# EasyEDA Pro project ProProject_flex_ir_golf_2024-10-07.epro

# Schematic Schematic1
Create Date: 2024-04-06; Page Name: P1; Project Name: flex_ir_golf; Schematic Name: Schematic1; Update Date: 2024-08-27; Company: EasyEDA.com; Drawn: EasyEDA; Page Size: A4; Part Number: JLCPCB-002; Reviewed: EasyEDA; Version: V0.1
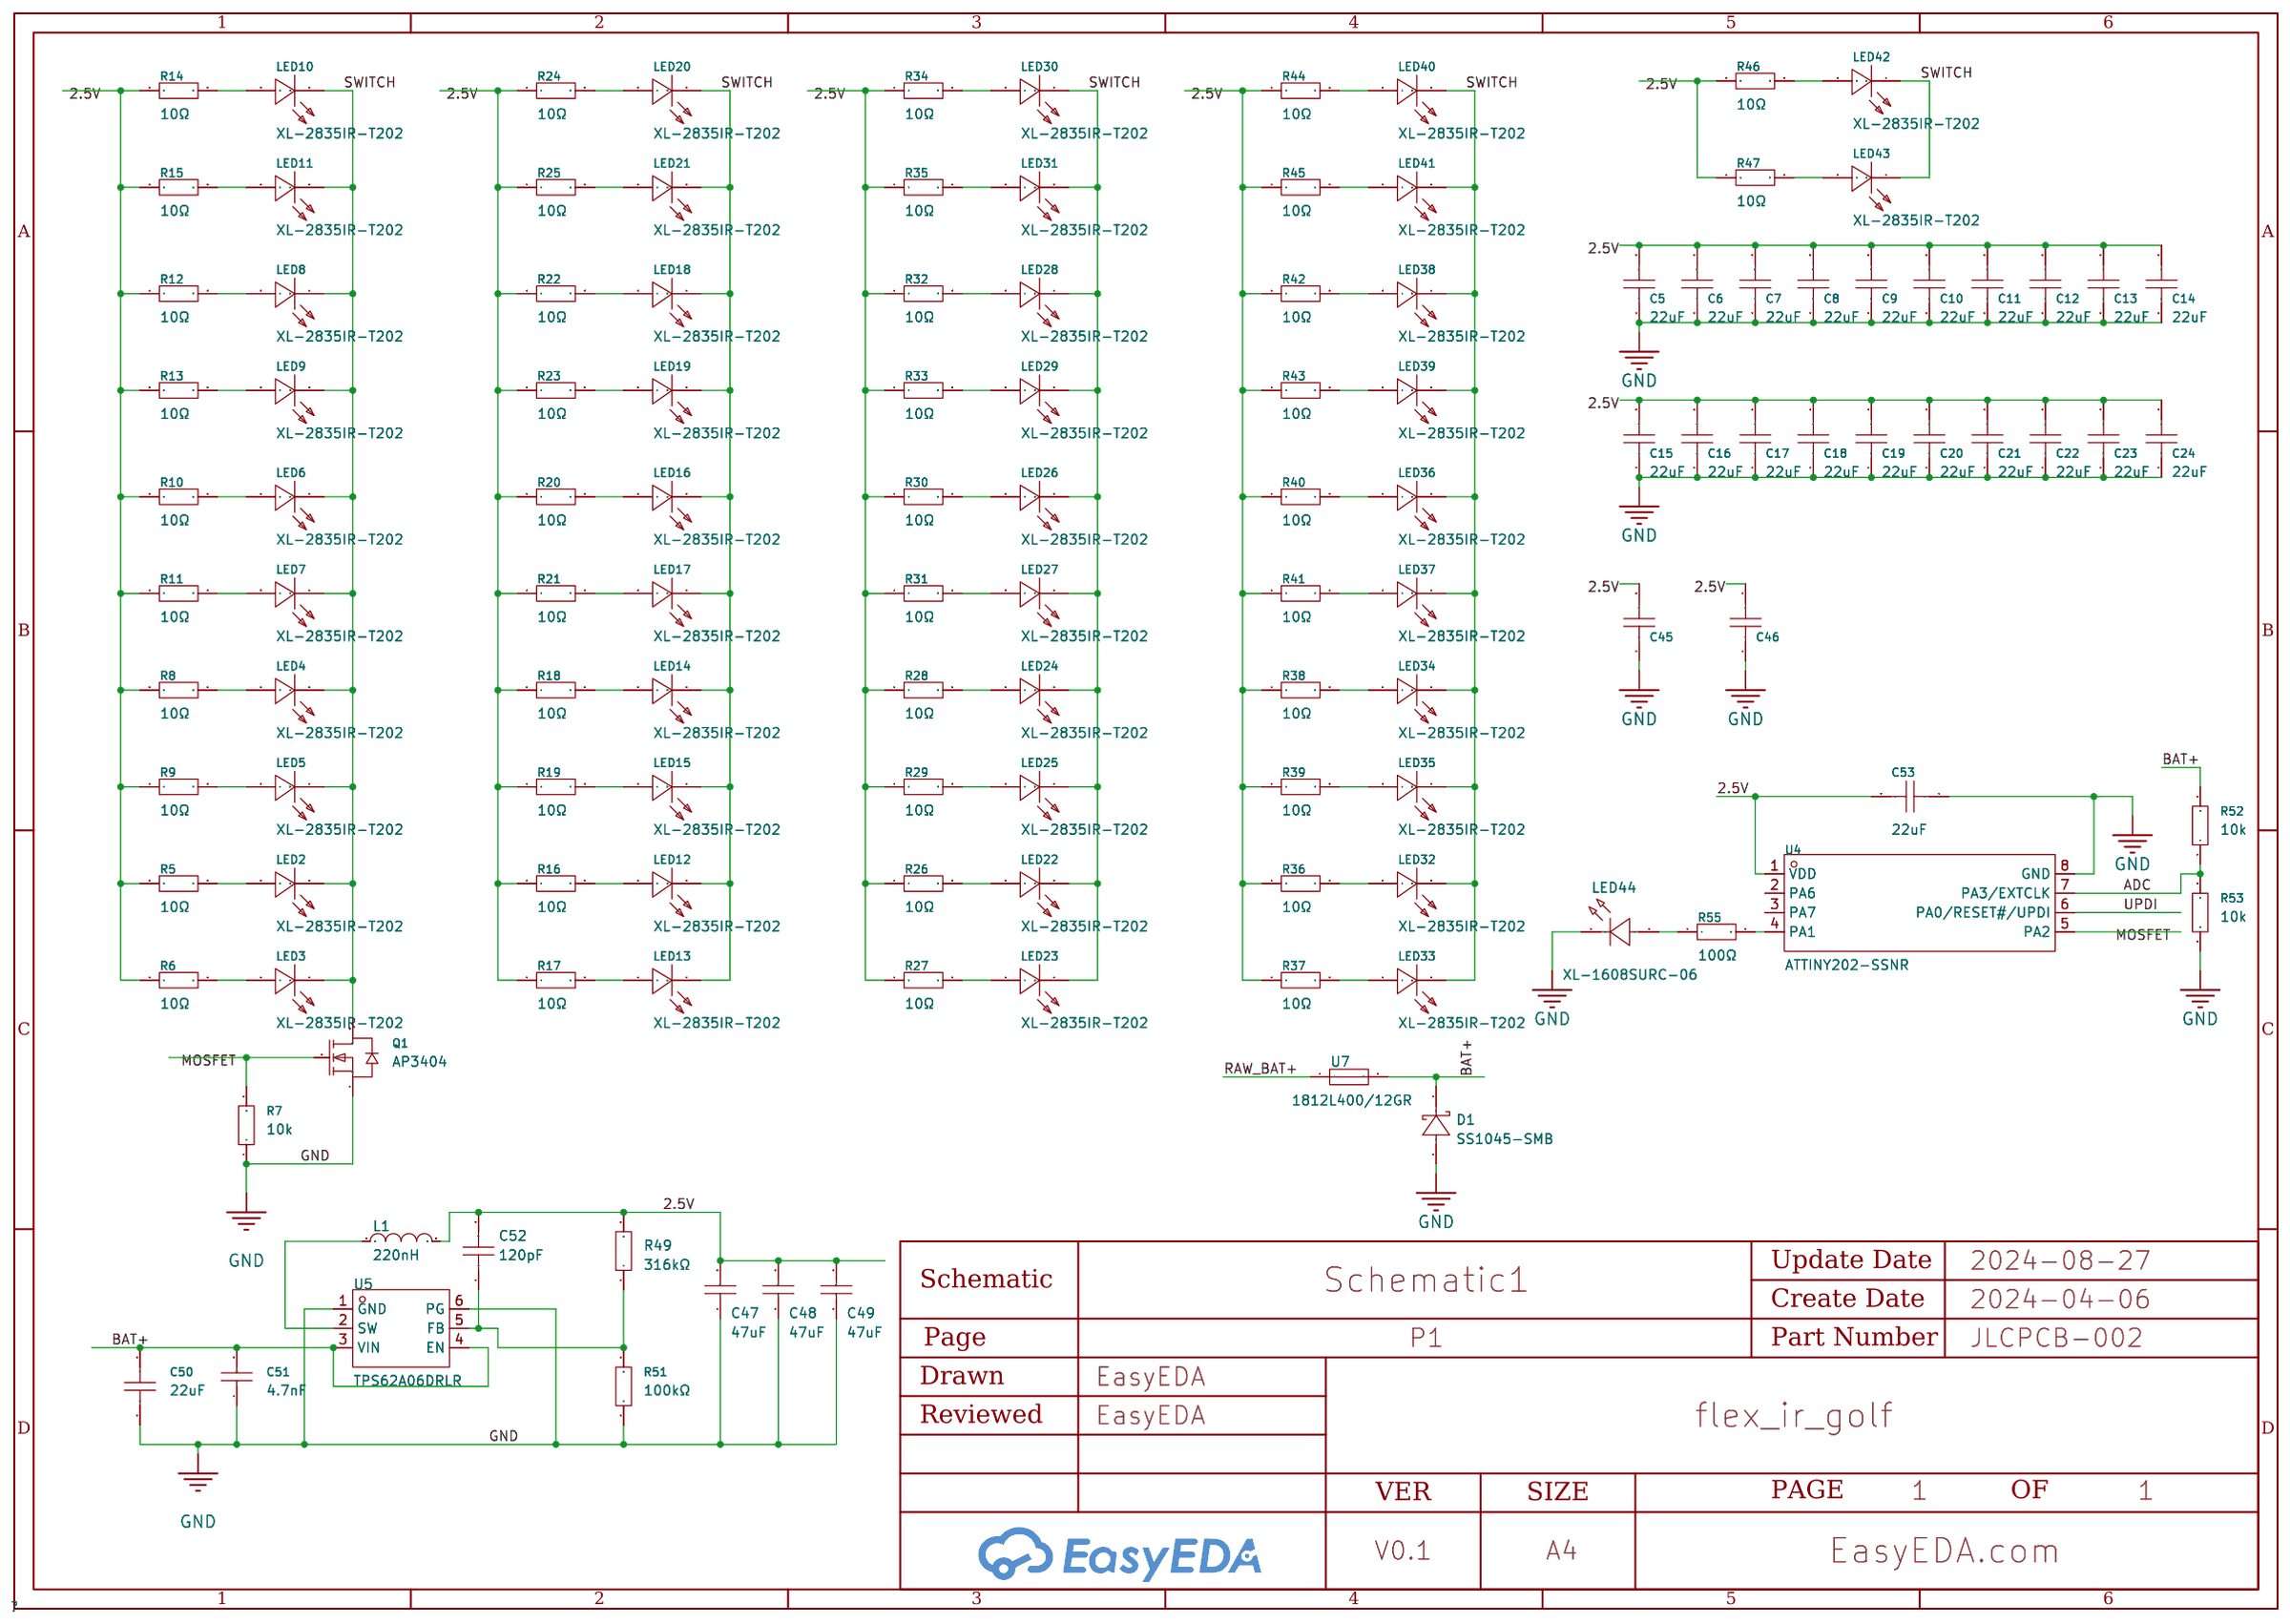
[diagram p0: schematic sheet]

## Parts
C5  22uF  [C0603]
C6  22uF  [C0603]
C7  22uF  [C0603]
C8  22uF  [C0603]
C9  22uF  [C0603]
C10  22uF  [C0603]
C11  22uF  [C0603]
C12  22uF  [C0603]
C13  22uF  [C0603]
C14  22uF  [C0603]
C15  22uF  [C0603]
C16  22uF  [C0603]
C17  22uF  [C0603]
C18  22uF  [C0603]
C19  22uF  [C0603]
C20  22uF  [C0603]
C21  22uF  [C0603]
C22  22uF  [C0603]
C23  22uF  [C0603]
C24  22uF  [C0603]
C45  22uF  [C0603]
C46  22uF  [C0603]
C47  47uF  [C0805]
C48  47uF  [C0805]
C49  47uF  [C0805]
C50  22uF  [C0603]
C51  4.7nF  [C0603]
C52  120pF  [C0603]
C53  22uF  [C0603]
D1  SS1045-SMB  [SMB_L4.4-W3.6-LS5.3-RD]
L1  220nH  [IND-SMD_L4.1-W4.1_IHLP1616BZER4R7M11]
LED2  XL-2835IR-T202  [LED-SMD_L128-XX80CB3500001]
LED3  XL-2835IR-T202  [LED-SMD_L128-XX80CB3500001]
LED4  XL-2835IR-T202  [LED-SMD_L128-XX80CB3500001]
LED5  XL-2835IR-T202  [LED-SMD_L128-XX80CB3500001]
LED6  XL-2835IR-T202  [LED-SMD_L128-XX80CB3500001]
LED7  XL-2835IR-T202  [LED-SMD_L128-XX80CB3500001]
LED8  XL-2835IR-T202  [LED-SMD_L128-XX80CB3500001]
LED9  XL-2835IR-T202  [LED-SMD_L128-XX80CB3500001]
LED10  XL-2835IR-T202  [LED-SMD_L128-XX80CB3500001]
LED11  XL-2835IR-T202  [LED-SMD_L128-XX80CB3500001]
LED12  XL-2835IR-T202  [LED-SMD_L128-XX80CB3500001]
LED13  XL-2835IR-T202  [LED-SMD_L128-XX80CB3500001]
LED14  XL-2835IR-T202  [LED-SMD_L128-XX80CB3500001]
LED15  XL-2835IR-T202  [LED-SMD_L128-XX80CB3500001]
LED16  XL-2835IR-T202  [LED-SMD_L128-XX80CB3500001]
LED17  XL-2835IR-T202  [LED-SMD_L128-XX80CB3500001]
LED18  XL-2835IR-T202  [LED-SMD_L128-XX80CB3500001]
LED19  XL-2835IR-T202  [LED-SMD_L128-XX80CB3500001]
LED20  XL-2835IR-T202  [LED-SMD_L128-XX80CB3500001]
LED21  XL-2835IR-T202  [LED-SMD_L128-XX80CB3500001]
LED22  XL-2835IR-T202  [LED-SMD_L128-XX80CB3500001]
LED23  XL-2835IR-T202  [LED-SMD_L128-XX80CB3500001]
LED24  XL-2835IR-T202  [LED-SMD_L128-XX80CB3500001]
LED25  XL-2835IR-T202  [LED-SMD_L128-XX80CB3500001]
LED26  XL-2835IR-T202  [LED-SMD_L128-XX80CB3500001]
LED27  XL-2835IR-T202  [LED-SMD_L128-XX80CB3500001]
LED28  XL-2835IR-T202  [LED-SMD_L128-XX80CB3500001]
LED29  XL-2835IR-T202  [LED-SMD_L128-XX80CB3500001]
LED30  XL-2835IR-T202  [LED-SMD_L128-XX80CB3500001]
LED31  XL-2835IR-T202  [LED-SMD_L128-XX80CB3500001]
LED32  XL-2835IR-T202  [LED-SMD_L128-XX80CB3500001]
LED33  XL-2835IR-T202  [LED-SMD_L128-XX80CB3500001]
LED34  XL-2835IR-T202  [LED-SMD_L128-XX80CB3500001]
LED35  XL-2835IR-T202  [LED-SMD_L128-XX80CB3500001]
LED36  XL-2835IR-T202  [LED-SMD_L128-XX80CB3500001]
LED37  XL-2835IR-T202  [LED-SMD_L128-XX80CB3500001]
LED38  XL-2835IR-T202  [LED-SMD_L128-XX80CB3500001]
LED39  XL-2835IR-T202  [LED-SMD_L128-XX80CB3500001]
LED40  XL-2835IR-T202  [LED-SMD_L128-XX80CB3500001]
LED41  XL-2835IR-T202  [LED-SMD_L128-XX80CB3500001]
LED42  XL-2835IR-T202  [LED-SMD_L128-XX80CB3500001]
LED43  XL-2835IR-T202  [LED-SMD_L128-XX80CB3500001]
LED44  XL-1608SURC-06  [LED0603-RD_RED]
Q1  AP3404  [SOT-23-3_L2.9-W1.3-P1.90-LS2.4-BR-2]
R5  10Ω  [R0603]
R6  10Ω  [R0603]
R7  10k  [R0603]
R8  10Ω  [R0603]
R9  10Ω  [R0603]
R10  10Ω  [R0603]
R11  10Ω  [R0603]
R12  10Ω  [R0603]
R13  10Ω  [R0603]
R14  10Ω  [R0603]
R15  10Ω  [R0603]
R16  10Ω  [R0603]
R17  10Ω  [R0603]
R18  10Ω  [R0603]
R19  10Ω  [R0603]
R20  10Ω  [R0603]
R21  10Ω  [R0603]
R22  10Ω  [R0603]
R23  10Ω  [R0603]
R24  10Ω  [R0603]
R25  10Ω  [R0603]
R26  10Ω  [R0603]
R27  10Ω  [R0603]
R28  10Ω  [R0603]
R29  10Ω  [R0603]
R30  10Ω  [R0603]
R31  10Ω  [R0603]
R32  10Ω  [R0603]
R33  10Ω  [R0603]
R34  10Ω  [R0603]
R35  10Ω  [R0603]
R36  10Ω  [R0603]
R37  10Ω  [R0603]
R38  10Ω  [R0603]
R39  10Ω  [R0603]
R40  10Ω  [R0603]
R41  10Ω  [R0603]
R42  10Ω  [R0603]
R43  10Ω  [R0603]
R44  10Ω  [R0603]
R45  10Ω  [R0603]
R46  10Ω  [R0603]
R47  10Ω  [R0603]
R49  316kΩ  [R0603]
R51  100kΩ  [R0603]
R52  10k  [R0603]
R53  10k  [R0603]
R55  100Ω  [R0603]
U4  ATTINY202-SSNR  [SOIC-8_L5.0-W4.0-P1.27-LS6.0-BL]
U5  TPS62A06DRLR  [SOT-563-6_L1.6-W1.2-P0.50-LS1.6-TL]
U7  1812L400/12GR  [F1812]

## Library data of the parts
C5-C24 C45 C46 C50 C53 = GRM188R60J226MEA0D: Capacitance: Tolerance:±20% Tolerance:±20% Voltage Rated: Temperature Coefficient:; LCSC Part Name: 22uF ±20% 6.3V; Supplier Part: C77042; Manufacturer: muRata(村田); Supplier Footprint: 0603; JLCPCB Part Class: Extended Part; Datasheet: https://atta.szlcsc.com/upload/public/pdf/source/20200305/C490387_23319AE8C154DEB24C505E6C82A8106A.pdf; Supplier: LCSC; Tolerance: ±20%
C47-C49 = C2012X5R1A476MTJ00E: Capacitance: Tolerance:±20% Tolerance:±20% Voltage Rated: Temperature Coefficient:; LCSC Part Name: 47uF ±20% 10V; Supplier Part: C76636; Manufacturer: TDK; Supplier Footprint: 0805; JLCPCB Part Class: Extended Part; Datasheet: https://atta.szlcsc.com/upload/public/pdf/source/20230606/A83975C7E70EF5AFCD4A17254ABD78F2.pdf; Supplier: LCSC; Tolerance: ±20%
C51 = CC0603KRX7R9BB472: Capacitance: Tolerance:±10% Tolerance:±10% Voltage Rated: Temperature Coefficient:; LCSC Part Name: 4.7nF ±10% 50V; Supplier Part: C106218; Manufacturer: YAGEO(国巨); Supplier Footprint: 0603; JLCPCB Part Class: Extended Part; Datasheet: https://atta.szlcsc.com/upload/public/pdf/source/20180910/C282072_33301C7F631E79921B82A8DAC6BCC5B3.pdf; Supplier: LCSC; Tolerance: ±10%
C52 = CL10C121JB8NNNC: Capacitance: Tolerance:±5% Tolerance:±5% Voltage Rated: Temperature Coefficient:; LCSC Part Name: 120pF ±5% 50V; Supplier Part: C18438; Manufacturer: SAMSUNG(三星); Supplier Footprint: 0603; JLCPCB Part Class: Extended Part; Datasheet: https://atta.szlcsc.com/upload/public/pdf/source/20160218/1457707763339.pdf; Supplier: LCSC; Tolerance: ±5%
D1 = SS1045-SMB: Diode Configuration:Single Forward Voltage (Vf@If):550mV@10A Reverse Voltage (Vr):45V Average Rectified Current (Io):10A Reverse Leakage Current (Ir):100uA@45V; LCSC Part Name: 电压:45V 电流:10A; Supplier Part: C2903947; Manufacturer: GOODWORK(固得沃克); Supplier Footprint: SMB(DO-214AA); JLCPCB Part Class: Extended Part; Datasheet: https://atta.szlcsc.com/upload/public/pdf/source/20211009/E4DBA06FC385524CB487926763981FDE.pdf; Supplier: LCSC; Diode Configuration: Single; Forward Voltage (Vf@If): 550mV@10A; Reverse Voltage (Vr): 45V; Average Rectified Current (Io): 10A; Reverse Leakage Current (Ir): 100uA@45V
L1 = IHLP1616BZERR22M01: Inductance: Tolerance:±20% Tolerance:±20% Rated Current: Saturation Current (Isat):24A DC Resistance (DCR): Ratings:-; LCSC Part Name: 220nH ±20% 24A; Supplier Part: C844981; Manufacturer: VISHAY(威世); Supplier Footprint: 1616; JLCPCB Part Class: Extended Part; Datasheet: https://atta.szlcsc.com/upload/public/pdf/source/20231218/7C3D4DFF03E0D8B7F5A3F136F971DD90.pdf; Supplier: LCSC; Tolerance: ±20%; Saturation Current (Isat): 24A
LED2-LED43 = L128-4080CB3500001_C358168: Emitted Color:White; LCSC Part Name: 白灯; Supplier Part: C5221243; Manufacturer: Lumileds(亮锐); Supplier Footprint: SMD2835; JLCPCB Part Class: Extended Part; Datasheet: https://atta.szlcsc.com/upload/public/pdf/source/20190124/C358170_8734630ADD1BE4D019D2695C6D605BA1.pdf; Supplier: LCSC; Emitted Color: IR
LED44 = XL-1608SURC-06: Emitted Color:Red Power Dissipation:55mW Forward Current:25mA Dominant Wavelength:617nm~621nm Dominant Wavelength:617nm~621nm Peak Wavelength:623nm Lens Color:无色透明透镜 Color Temperature:- Color Temperature:- Viewing Angle:120° Mounting Sytle:Positive post O; Supplier Part: C965799; Manufacturer: XINGLIGHT(成兴光); Supplier Footprint: 0603; JLCPCB Part Class: Extended Part; Datasheet: https://atta.szlcsc.com/upload/public/pdf/source/20221102/D860AFDD1CDB02C5A8064103A32707E2.pdf; Supplier: LCSC; Emitted Color: Red; Power Dissipation: 55mW; Forward Current: 25mA; Dominant Wavelength: 617nm~621nm; Peak Wavelength: 623nm; Lens Color: 无色透明透镜; Viewing Angle: 120°; Mounting Sytle: Positive post; Operating Temperature: -30℃~+85℃
Q1 = AP3404: Type: Drain Source Voltage (Vdss): Continuous Drain Current (Id): Power Dissipation (Pd): Drain Source On Resistance (RDS(on)@Vgs,Id):18mΩ@10V,5.8A Gate Threshold Voltage (Vgs(th)@Id):1.6V@250uA Total Gate Charge (Qg@Vgs):- Input Capacitance (Ciss@Vds):34; LCSC Part Name: N沟道 耐压:30V 电流:5.8A; Supplier Part: C2842665; Manufacturer: ALLPOWER(铨力); Supplier Footprint: SOT-23; JLCPCB Part Class: Extended Part; Datasheet: https://atta.szlcsc.com/upload/public/pdf/source/20210629/C2842665_6746D340194B1D8C1AEB6994A54BD307.pdf; Supplier: LCSC; Drain Source On Resistance (RDS(on)@Vgs,Id): 18mΩ@10V,5.8A; Gate Threshold Voltage (Vgs(th)@Id): 1.6V@250uA; Input Capacitance (Ciss@Vds): 345pF@15V; Reverse Transfer Capacitance (Crss@Vds): 32pF@15V; Operating Temperature: -55℃~+150℃@(Tj)
R5-R47 R52 R53 = 0603WAF100JT5E: Type:Thick Film Resistors Resistance:10Ω Tolerance:±1% Tolerance:±1% Power(Watts): Overload Voltage (Max): Temperature Coefficient:±400ppm/℃ Temperature Coefficient:±400ppm/℃ Operating Temperature Range:-55℃~+155℃ Operating Temperature Range:-55℃~+155℃; LCSC Part Name: 10Ω ±1% 100mW 厚膜电阻; Supplier Part: C22859; Manufacturer: UNI-ROYAL(厚声); Supplier Footprint: 0603; JLCPCB Part Class: Basic Part; Datasheet: https://atta.szlcsc.com/upload/public/pdf/source/20200306/C422600_1E6D84923E4A46A82E41ADD87F860B5C.pdf; Supplier: LCSC; Type: Thick Film Resistors; Tolerance: ±1%; Temperature Coefficient: ±400ppm/℃; Operating Temperature Range: -55℃~+155℃
R49 = RC0603FR-07316KL: Type:Thick Film Resistors Resistance: Tolerance:±1% Tolerance:±1% Power(Watts): Overload Voltage (Max): Temperature Coefficient:±100ppm/℃ Temperature Coefficient:±100ppm/℃ Operating Temperature Range:-55℃~+155℃ Operating Temperature Range:-55℃~+155℃; LCSC Part Name: 厚膜电阻 316kΩ ±1% 100mW; Supplier Part: C185340; Manufacturer: YAGEO(国巨); Supplier Footprint: 0603; JLCPCB Part Class: Extended Part; Datasheet: https://atta.szlcsc.com/upload/public/pdf/source/20180904/C276339_014E484F1DBA106FB92D45EABD5A1AC1.pdf; Supplier: LCSC; Type: Thick Film Resistors; Tolerance: ±1%; Temperature Coefficient: ±100ppm/℃; Operating Temperature Range: -55℃~+155℃
R51 = RC0603FR-07100KL: Type:Thick Film Resistors Resistance: Tolerance:±1% Tolerance:±1% Power(Watts): Overload Voltage (Max): Temperature Coefficient:±100ppm/℃ Temperature Coefficient:±100ppm/℃ Operating Temperature Range:-55℃~+155℃ Operating Temperature Range:-55℃~+155℃; LCSC Part Name: 厚膜电阻 100kΩ ±1% 100mW; Supplier Part: C14675; Manufacturer: YAGEO(国巨); Supplier Footprint: 0603; JLCPCB Part Class: Extended Part; Datasheet: https://atta.szlcsc.com/upload/public/pdf/source/20140324/1457707028752.pdf; Supplier: LCSC; Type: Thick Film Resistors; Tolerance: ±1%; Temperature Coefficient: ±100ppm/℃; Operating Temperature Range: -55℃~+155℃
R55 = 0603WAJ0101T5E: Type:Thick Film Resistors Resistance: Tolerance:±5% Tolerance:±5% Power(Watts): Overload Voltage (Max): Temperature Coefficient:±100ppm/℃ Temperature Coefficient:±100ppm/℃ Operating Temperature Range:-55℃~+155℃ Operating Temperature Range:-55℃~+155℃; LCSC Part Name: 100Ω ±5% 100mW 厚膜电阻; Supplier Part: C25201; Manufacturer: UNI-ROYAL(厚声); Supplier Footprint: 0603; JLCPCB Part Class: Extended Part; Datasheet: https://atta.szlcsc.com/upload/public/pdf/source/20200306/C422600_1E6D84923E4A46A82E41ADD87F860B5C.pdf; Supplier: LCSC; Type: Thick Film Resistors; Tolerance: ±5%; Temperature Coefficient: ±100ppm/℃; Operating Temperature Range: -55℃~+155℃
U4 = ATTINY202-SSNR: CPU Core:AVR Program Storage Size:2KB RAM Size:128Byte GPIO Ports Number:6 Operating Voltage Range:1.8V~5.5V Operating Voltage Range:1.8V~5.5V CPU Maximum Speed:20MHz Program Memory Type:FLASH Operating Temperature Range:-40℃~+105℃ Operating Temperature R; Supplier Part: C2052951; Manufacturer: MICROCHIP(美国微芯); Supplier Footprint: SOIC-8; JLCPCB Part Class: Extended Part; Datasheet: https://atta.szlcsc.com/upload/public/pdf/source/20210630/C2052951_DF1F867FA15E2F0F74210386DED84B7F.pdf; Supplier: LCSC; CPU Core: AVR; Program Storage Size: 2KB; RAM Size: 128Byte; GPIO Ports Number: 6; Operating Voltage Range: 1.8V~5.5V; CPU Maximum Speed: 20MHz; Program Memory Type: FLASH; Operating Temperature Range: -40℃~+105℃; ADC (Bit): 10bit; Peripheral/Function: WDT；LIN总线协议；IrDA; Watchdog: 有; Infrared Data Association: 有; Low-Voltage Detect: 有; Internal Oscillator: 有
U5 = TPS62A06DRLR: Supplier Part: C22365365; Manufacturer: TI(德州仪器); Supplier Footprint: SOT-5X3-6; JLCPCB Part Class: Extended Part; Datasheet: https://atta.szlcsc.com/upload/public/pdf/source/20240321/41946EFE8F53C92CA8741079F1A5949F.pdf; Supplier: LCSC
U7 = 1812L400/12GR: Operating Voltage (Max):12V Current Rating (Max):40A Hold Current:4A Trip Current:7A Power Dissipation:2W Resistance - Initial (Ri) (Min):5mΩ Resistance - Post Trip (R1) (Max):25mΩ Maximum Time to Trip:4ms Operating Temperature:-40℃~+85℃ Operating Tempera; LCSC Part Name: 12V 4A 1812自恢复; Supplier Part: C7542976; Manufacturer: LUTE(陆特); Supplier Footprint: 1812; JLCPCB Part Class: Extended Part; Datasheet: https://atta.szlcsc.com/upload/public/pdf/source/20230824/A44D5C29BF5EAF37C9B8C94242010A73.pdf; Supplier: LCSC; Operating Voltage (Max): 12V; Current Rating (Max): 40A; Hold Current: 4A; Trip Current: 7A; Power Dissipation: 2W; Resistance - Initial (Ri) (Min): 5mΩ; Resistance - Post Trip (R1) (Max): 25mΩ; Maximum Time to Trip: 4ms; Operating Temperature: -40℃~+85℃

## Nets
2.5V: C5.2 C6.2 C7.2 C8.2 C9.2 C10.2 C11.2 C12.2 C13.2 C14.2 C15.2 C16.2 C17.2 C18.2 C19.2 C20.2 C21.2 C22.2 C23.2 C24.2 C45.2 C46.2 C47.2 C48.2 C49.2 C52.2 C53.2 L1.2 R5.1 R6.1 R8.1 R9.1 R10.1 R11.1 R12.1 R13.1 R14.1 R15.1 R16.1 R17.1 R18.1 R19.1 R20.1 R21.1 R22.1 R23.1 R24.1 R25.1 R26.1 R27.1 R28.1 R29.1 R30.1 R31.1 R32.1 R33.1 R34.1 R35.1 R36.1 R37.1 R38.1 R39.1 R40.1 R41.1 R42.1 R43.1 R44.1 R45.1 R46.1 R47.1 R49.2 U4.1(VDD)
GND: C5.1 C6.1 C7.1 C8.1 C9.1 C10.1 C11.1 C12.1 C13.1 C14.1 C15.1 C16.1 C17.1 C18.1 C19.1 C20.1 C21.1 C22.1 C23.1 C24.1 C45.1 C46.1 C47.1 C48.1 C49.1 C50.1 C51.1 C53.1 D1.2 LED44.1(K) Q1.1(S) R7.1 R51.1 R53.1 U4.8(GND) U5.1(GND) U5.6(PG)
ADC: R52.1 R53.2 U4.7(PA3/EXTCLK)
BAT+: C50.2 C51.2 D1.1 R52.2 U5.3(VIN) U5.4(EN) U7.2
MOSFET: Q1.2(G) R7.2 U4.5(PA2)
RAW_BAT+: U7.1
SWITCH: LED2.1(C) LED3.1(C) LED4.1(C) LED5.1(C) LED6.1(C) LED7.1(C) LED8.1(C) LED9.1(C) LED10.1(C) LED11.1(C) LED12.1(C) LED13.1(C) LED14.1(C) LED15.1(C) LED16.1(C) LED17.1(C) LED18.1(C) LED19.1(C) LED20.1(C) LED21.1(C) LED22.1(C) LED23.1(C) LED24.1(C) LED25.1(C) LED26.1(C) LED27.1(C) LED28.1(C) LED29.1(C) LED30.1(C) LED31.1(C) LED32.1(C) LED33.1(C) LED34.1(C) LED35.1(C) LED36.1(C) LED37.1(C) LED38.1(C) LED39.1(C) LED40.1(C) LED41.1(C) LED42.1(C) LED43.1(C) Q1.3(D)
UPDI: U4.6(PA0/RESET#/UPDI)
$1N2397: LED2.2(A) R5.2
$1N2467: LED3.2(A) R6.2
$1N2959: LED4.2(A) R8.2
$1N2961: LED5.2(A) R9.2
$1N3108: LED6.2(A) R10.2
$1N3110: LED7.2(A) R11.2
$1N3257: LED8.2(A) R12.2
$1N3259: LED9.2(A) R13.2
$1N3406: LED10.2(A) R14.2
$1N3408: LED11.2(A) R15.2
$1N4472: LED12.2(A) R16.2
$1N4474: LED13.2(A) R17.2
$1N4476: LED14.2(A) R18.2
$1N4478: LED15.2(A) R19.2
$1N4480: LED16.2(A) R20.2
$1N4482: LED17.2(A) R21.2
$1N4484: LED18.2(A) R22.2
$1N4486: LED19.2(A) R23.2
$1N4488: LED20.2(A) R24.2
$1N4490: LED21.2(A) R25.2
$1N5215: LED22.2(A) R26.2
$1N5217: LED23.2(A) R27.2
$1N5219: LED24.2(A) R28.2
$1N5221: LED25.2(A) R29.2
$1N5223: LED26.2(A) R30.2
$1N5225: LED27.2(A) R31.2
$1N5227: LED28.2(A) R32.2
$1N5229: LED29.2(A) R33.2
$1N5231: LED30.2(A) R34.2
$1N5233: LED31.2(A) R35.2
$1N5958: LED32.2(A) R36.2
$1N5960: LED33.2(A) R37.2
$1N5962: LED34.2(A) R38.2
$1N5964: LED35.2(A) R39.2
$1N5966: LED36.2(A) R40.2
$1N5968: LED37.2(A) R41.2
$1N5970: LED38.2(A) R42.2
$1N5972: LED39.2(A) R43.2
$1N5974: LED40.2(A) R44.2
$1N5976: LED41.2(A) R45.2
$1N6160: LED42.2(A) R46.2
$1N6162: LED43.2(A) R47.2
$1N26713: L1.1 U5.2(SW)
$1N26861: C52.1 R49.1 R51.2 U5.5(FB)
$1N27838: LED44.2(A) R55.1
$1N27880: R55.2 U4.4(PA1)

Not connected (* = marked no-connect by the designer): U4 2(PA6) 3(PA7)

# Board PCB1
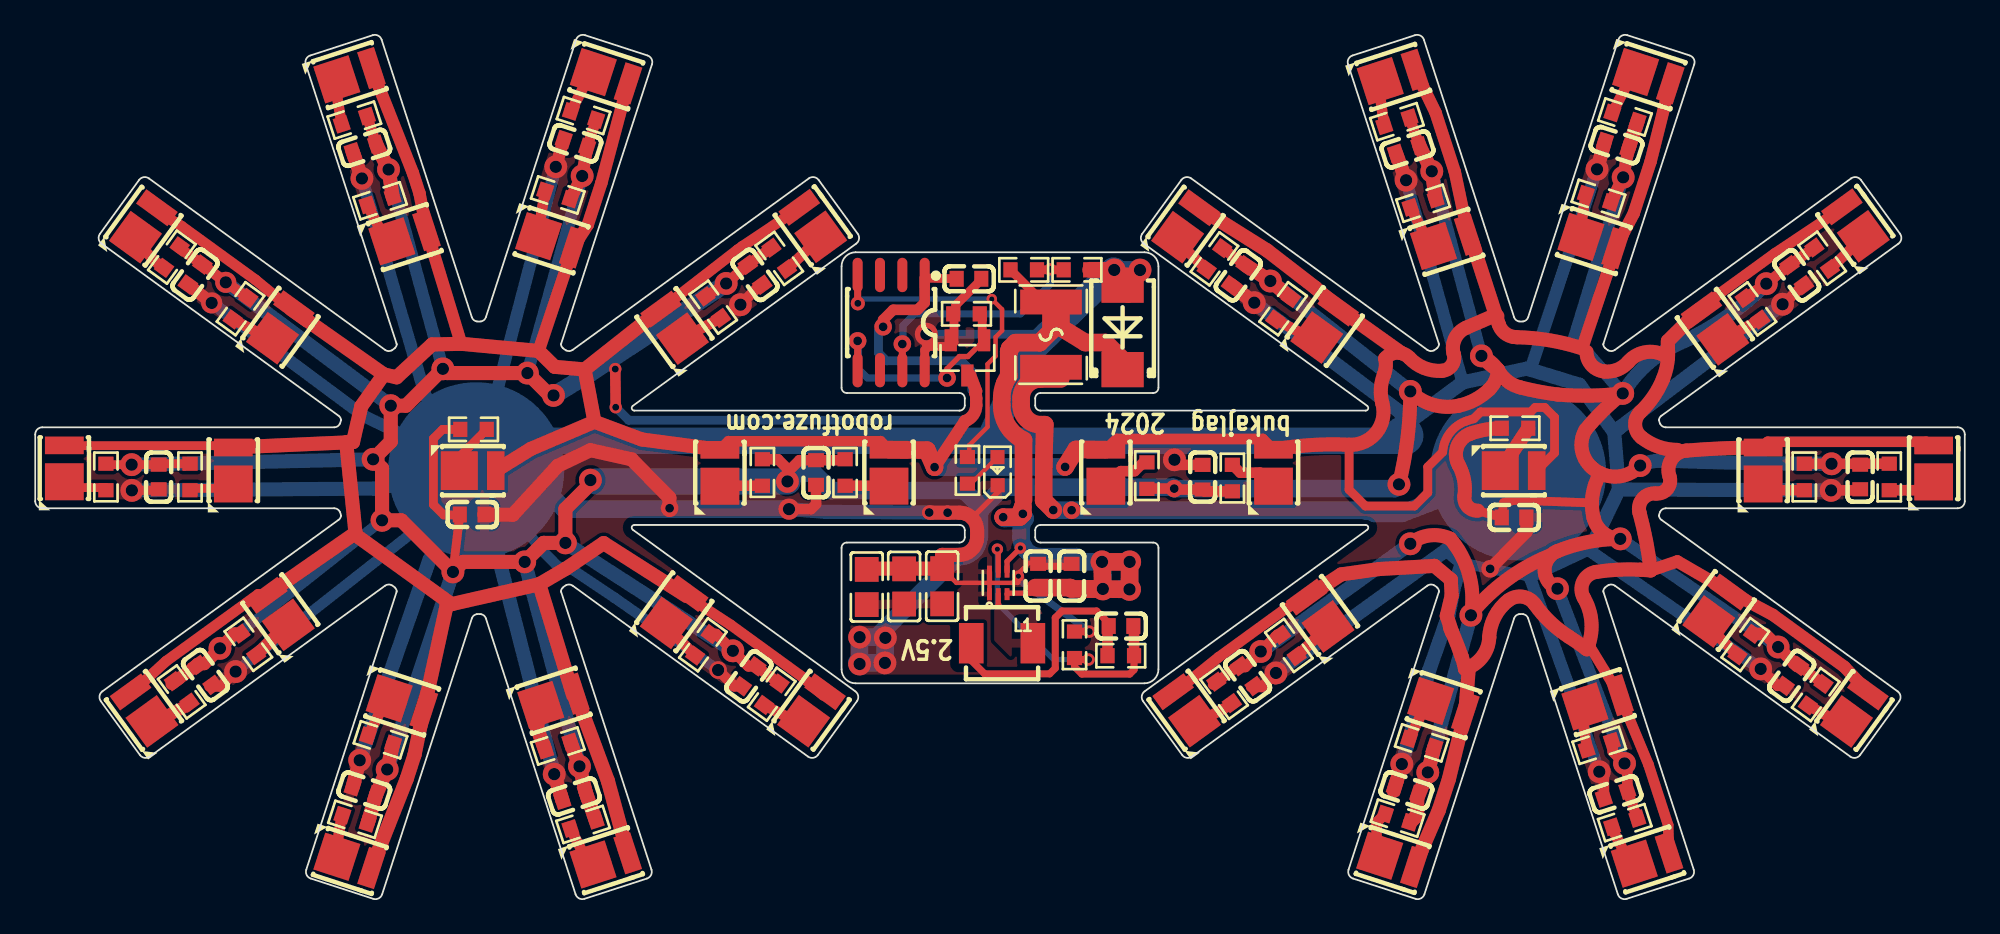
[diagram p1: board, top side]
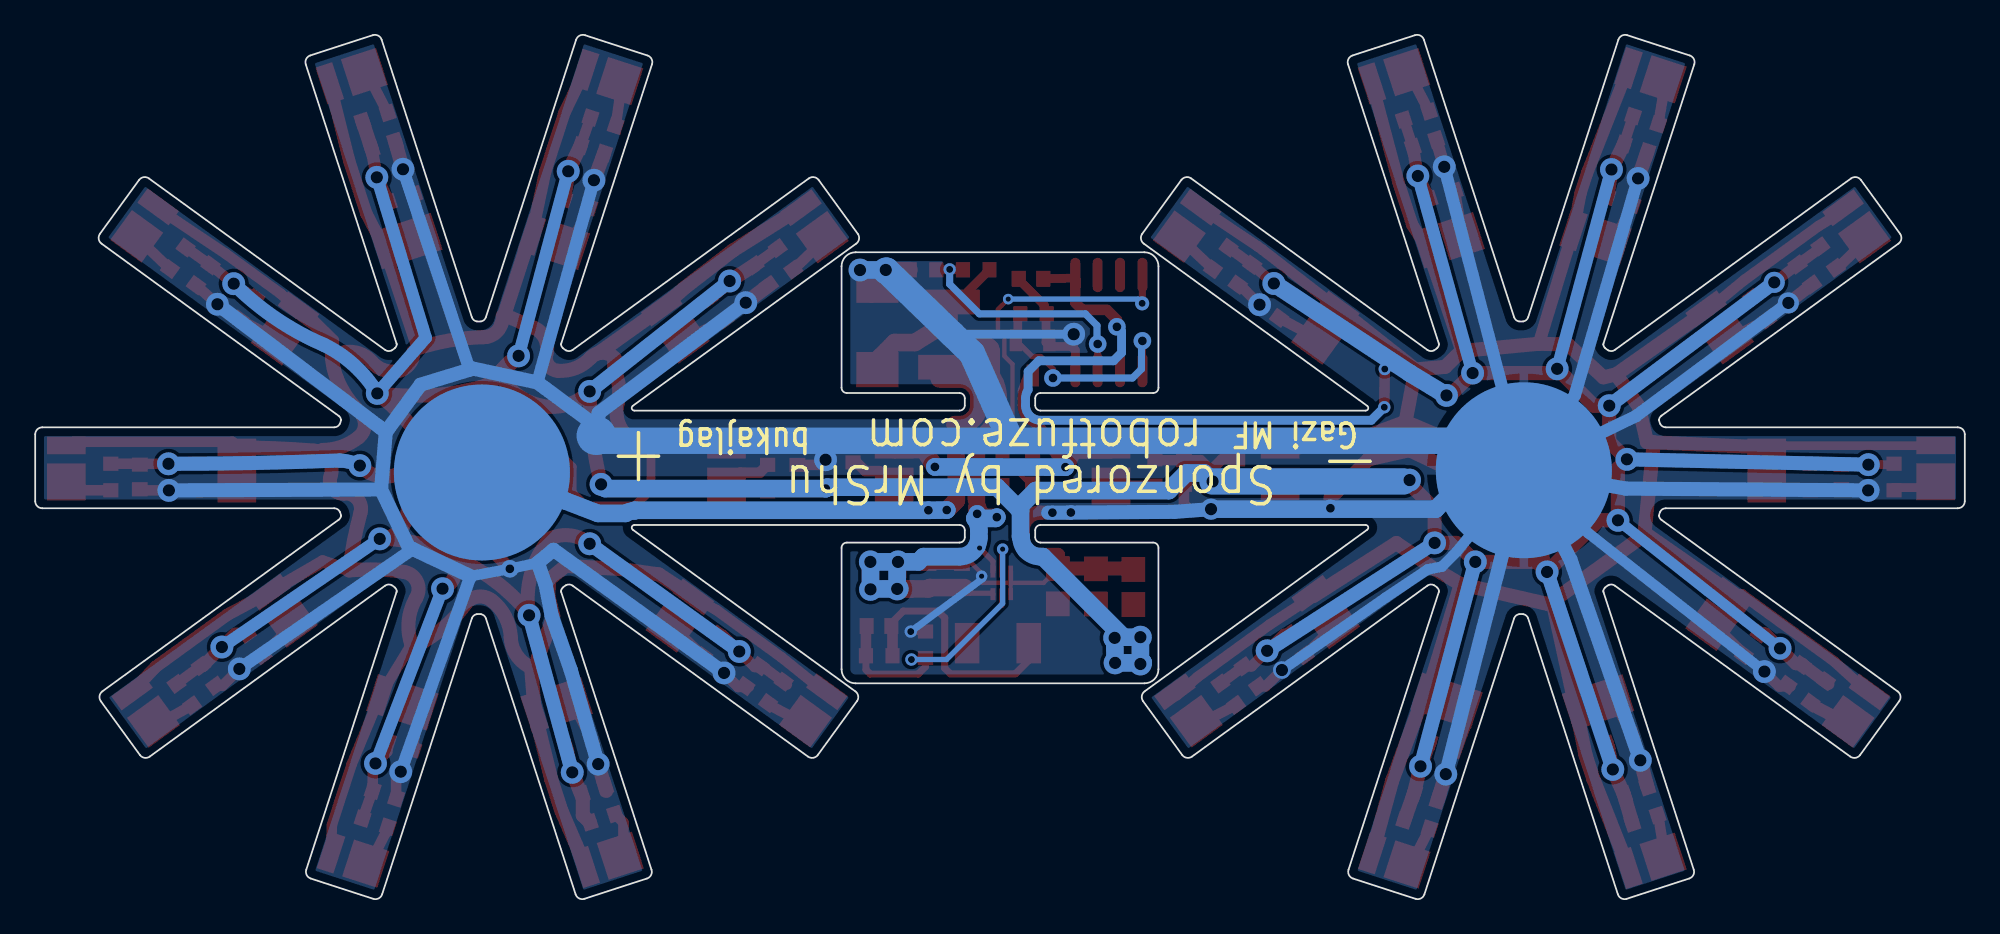
[diagram p2: board, bottom side, seen from below]

Outline 109.6 x 49.09 mm; copper layers: Top Layer, Bottom Layer. Coordinates in mm from the lower left corner of the outline.
Stack: Top Layer 0.012mm / Dielectric1 0.025mm FR4 er 4.5 / Bottom Layer 0.012mm

## Design rules (mm)
template: Custom Config
spacing copperThickness1oz (default): track to track 0.102, other pairs 0.152 to 0.3
spacing copperThickness2oz: track to track 0.203, other pairs 0.152 to 0.3
track width copperThickness1oz (default): min 0.127, default 0.254, max 2.54
track width copperThickness2oz: min 0.203, default 0.254, max 2.54
differential pair differentialPair (default): width min 0.127, default 0.254, max 2.54; gap min 0.152, default 0.152
via viaSize (default): diameter min 0.5, default 0.61, max 10; hole min 0.3, default 0.305, max 6.3
net 2.5V uses copperFULL
net $1N26713 uses copperFULL
net RAW_BAT+ uses copperFULL

## Placement (name value [footprint] x y rotation side)
C5  22uF  [C0603]  44.35 24.23 90 top
C6  22uF  [C0603]  7.01 23.98 90 top
C7  22uF  [C0603]  89.83 42.84 342 top
C8  22uF  [C0603]  89.77 5.94 18 top
C9  22uF  [C0603]  77.96 42.59 18 top
C10  22uF  [C0603]  30.61 5.82 18 top
C11  22uF  [C0603]  18.7 42.68 18 top
C12  22uF  [C0603]  103.66 23.98 90 top
C13  22uF  [C0603]  66.31 23.96 270 top
C14  22uF  [C0603]  99.77 12.67 54 top
C15  22uF  [C0603]  18.7 6.15 342 top
C16  22uF  [C0603]  30.69 42.94 342 top
C17  22uF  [C0603]  77.89 6.16 342 top
C18  22uF  [C0603]  9.67 12.72 126 top
C19  22uF  [C0603]  40.88 35.47 126 top
C20  22uF  [C0603]  68.86 12.66 126 top
C21  22uF  [C0603]  100.05 35.44 126 top
C22  22uF  [C0603]  40.54 12.65 54 top
C23  22uF  [C0603]  68.34 35.44 54 top
C24  22uF  [C0603]  24.82 21.84 180 top
C45  22uF  [C0603]  9.08 35.48 54 top
C46  22uF  [C0603]  84 21.68 180 top
C47  47uF  [C0805]  51.51 17.77 270 top
C48  47uF  [C0805]  49.36 17.75 270 top
C49  47uF  [C0805]  47.23 17.72 270 top
C50  22uF  [C0603]  58.87 18.34 270 top
C51  4.7nF  [C0603]  56.96 18.34 270 top
C52  120pF  [C0603]  61.67 15.51 180 top
C53  22uF  [C0603]  53.04 35.24 180 top
D1  SS1045-SMB  [SMB_L4.4-W3.6-LS5.3-RD]  61.76 32.48 90 top
L1  220nH  [IND-SMD_L4.1-W4.1_IHLP1616BZER4R7M11]  54.92 14.53 180 top
LED2  XL-2835IR-T202  [LED-SMD_L128-XX80CB3500001]  6.3 38.44 234 top
LED3  XL-2835IR-T202  [LED-SMD_L128-XX80CB3500001]  14.09 32.7 234 top
LED4  XL-2835IR-T202  [LED-SMD_L128-XX80CB3500001]  11.25 24.62 270 top
LED5  XL-2835IR-T202  [LED-SMD_L128-XX80CB3500001]  1.65 24.74 270 top
LED6  XL-2835IR-T202  [LED-SMD_L128-XX80CB3500001]  48.5 24.49 270 top
LED7  XL-2835IR-T202  [LED-SMD_L128-XX80CB3500001]  38.89 24.48 270 top
LED8  XL-2835IR-T202  [LED-SMD_L128-XX80CB3500001]  70.34 24.49 270 top
LED9  XL-2835IR-T202  [LED-SMD_L128-XX80CB3500001]  60.81 24.49 270 top
LED10  XL-2835IR-T202  [LED-SMD_L128-XX80CB3500001]  107.83 24.73 270 top
LED11  XL-2835IR-T202  [LED-SMD_L128-XX80CB3500001]  98.15 24.62 270 top
LED12  XL-2835IR-T202  [LED-SMD_L128-XX80CB3500001]  36.46 16.52 234 top
LED13  XL-2835IR-T202  [LED-SMD_L128-XX80CB3500001]  44.25 10.93 234 top
LED14  XL-2835IR-T202  [LED-SMD_L128-XX80CB3500001]  80.41 37.43 198 top
LED15  XL-2835IR-T202  [LED-SMD_L128-XX80CB3500001]  77.38 46.8 198 top
LED16  XL-2835IR-T202  [LED-SMD_L128-XX80CB3500001]  91.82 2.32 198 top
LED17  XL-2835IR-T202  [LED-SMD_L128-XX80CB3500001]  89.01 11.26 198 top
LED18  XL-2835IR-T202  [LED-SMD_L128-XX80CB3500001]  21.24 37.69 198 top
LED19  XL-2835IR-T202  [LED-SMD_L128-XX80CB3500001]  18.12 46.9 198 top
LED20  XL-2835IR-T202  [LED-SMD_L128-XX80CB3500001]  32.67 2.27 198 top
LED21  XL-2835IR-T202  [LED-SMD_L128-XX80CB3500001]  29.7 11.34 198 top
LED22  XL-2835IR-T202  [LED-SMD_L128-XX80CB3500001]  73.4 32.74 234 top
LED23  XL-2835IR-T202  [LED-SMD_L128-XX80CB3500001]  65.5 38.44 234 top
LED24  XL-2835IR-T202  [LED-SMD_L128-XX80CB3500001]  21.09 11.08 162 top
LED25  XL-2835IR-T202  [LED-SMD_L128-XX80CB3500001]  18.12 2.07 162 top
LED26  XL-2835IR-T202  [LED-SMD_L128-XX80CB3500001]  32.69 46.67 162 top
LED27  XL-2835IR-T202  [LED-SMD_L128-XX80CB3500001]  29.57 37.34 162 top
LED28  XL-2835IR-T202  [LED-SMD_L128-XX80CB3500001]  80.25 10.92 162 top
LED29  XL-2835IR-T202  [LED-SMD_L128-XX80CB3500001]  77.35 2.13 162 top
LED30  XL-2835IR-T202  [LED-SMD_L128-XX80CB3500001]  91.89 46.67 162 top
LED31  XL-2835IR-T202  [LED-SMD_L128-XX80CB3500001]  88.78 37.3 162 top
LED32  XL-2835IR-T202  [LED-SMD_L128-XX80CB3500001]  95.67 16.6 234 top
LED33  XL-2835IR-T202  [LED-SMD_L128-XX80CB3500001]  103.49 10.92 234 top
LED34  XL-2835IR-T202  [LED-SMD_L128-XX80CB3500001]  36.16 32.68 306 top
LED35  XL-2835IR-T202  [LED-SMD_L128-XX80CB3500001]  44.01 38.47 306 top
LED36  XL-2835IR-T202  [LED-SMD_L128-XX80CB3500001]  6.02 10.92 306 top
LED37  XL-2835IR-T202  [LED-SMD_L128-XX80CB3500001]  13.77 16.41 306 top
LED38  XL-2835IR-T202  [LED-SMD_L128-XX80CB3500001]  72.83 16.32 306 top
LED39  XL-2835IR-T202  [LED-SMD_L128-XX80CB3500001]  65.24 10.93 306 top
LED40  XL-2835IR-T202  [LED-SMD_L128-XX80CB3500001]  95.25 32.64 306 top
LED41  XL-2835IR-T202  [LED-SMD_L128-XX80CB3500001]  103.23 38.49 306 top
LED42  XL-2835IR-T202  [LED-SMD_L128-XX80CB3500001]  25.12 24.33 180 top
LED43  XL-2835IR-T202  [LED-SMD_L128-XX80CB3500001]  84.25 24.33 180 top
LED44  XL-1608SURC-06  [LED0603-RD_RED]  54.66 24.31 90 top
NOREF  -  [Pad_e599]  25.05 24.36 180 top
NOREF#2  -  [Pad_e597]  84.23 24.23 180 top
Q1  AP3404  [SOT-23-3_L2.9-W1.3-P1.90-LS2.4-BR-2]  52.95 30.75 180 top
R5  10Ω  [R0603]  7.76 36.47 234 top
R6  10Ω  [R0603]  11.66 33.54 234 top
R7  10k  [R0603]  52.9 33.25 0 top
R8  10Ω  [R0603]  8.79 23.98 270 top
R9  10Ω  [R0603]  4.02 23.98 270 top
R10  10Ω  [R0603]  46 24.23 270 top
R11  10Ω  [R0603]  41.3 24.23 270 top
R12  10Ω  [R0603]  68 23.91 90 top
R13  10Ω  [R0603]  63.15 24.05 90 top
R14  10Ω  [R0603]  105.31 23.98 270 top
R15  10Ω  [R0603]  100.49 23.98 270 top
R16  10Ω  [R0603]  37.93 14.44 234 top
R17  10Ω  [R0603]  41.84 11.63 234 top
R18  10Ω  [R0603]  78.83 39.53 198 top
R19  10Ω  [R0603]  77.35 44.17 198 top
R20  10Ω  [R0603]  90.29 4.33 198 top
R21  10Ω  [R0603]  88.84 8.72 198 top
R22  10Ω  [R0603]  19.59 39.67 198 top
R23  10Ω  [R0603]  18.13 44.26 198 top
R24  10Ω  [R0603]  31.12 4.23 198 top
R25  10Ω  [R0603]  29.68 8.69 198 top
R26  10Ω  [R0603]  70.88 33.54 234 top
R27  10Ω  [R0603]  66.98 36.37 234 top
R28  10Ω  [R0603]  19.61 9.04 162 top
R29  10Ω  [R0603]  18.16 4.52 162 top
R30  10Ω  [R0603]  31.15 44.52 162 top
R31  10Ω  [R0603]  29.68 40 162 top
R32  10Ω  [R0603]  78.76 8.86 162 top
R33  10Ω  [R0603]  77.38 4.58 162 top
R34  10Ω  [R0603]  90.3 44.44 162 top
R35  10Ω  [R0603]  88.79 39.81 162 top
R36  10Ω  [R0603]  97.13 14.45 234 top
R37  10Ω  [R0603]  101.13 11.61 234 top
R38  10Ω  [R0603]  38.51 33.63 306 top
R39  10Ω  [R0603]  42.26 36.4 306 top
R40  10Ω  [R0603]  8.32 11.76 306 top
R41  10Ω  [R0603]  12.11 14.46 306 top
R42  10Ω  [R0603]  71.21 14.4 306 top
R43  10Ω  [R0603]  67.53 11.73 306 top
R44  10Ω  [R0603]  97.54 33.53 306 top
R45  10Ω  [R0603]  101.5 36.41 306 top
R46  10Ω  [R0603]  24.9 26.68 0 top
R47  10Ω  [R0603]  84.05 26.75 0 top
R49  316kΩ  [R0603]  61.66 13.82 180 top
R51  100kΩ  [R0603]  59.03 14.44 270 top
R52  10k  [R0603]  56.15 35.75 180 top
R53  10k  [R0603]  59.17 35.75 180 top
R55  100Ω  [R0603]  52.95 24.36 90 top
U4  ATTINY202-SSNR  [SOIC-8_L5.0-W4.0-P1.27-LS6.0-BL]  48.62 32.75 180 top
U5  TPS62A06DRLR  [SOT-563-6_L1.6-W1.2-P0.50-LS1.6-TL]  54.7 17.96 90 top
U7  1812L400/12GR  [F1812]  57.7 32.07 90 top

## Footprints (pads in the part's own frame, mm; a bottom-side part is the same pattern mirrored in y, then rotated)
C0603
  rect 0.8x0.9 smd: 1(-0.7,0) 2(0.7,0)
C0805
  rect 1.41x1.35 smd: 1(-1,0) 2(1,0)
F1812
  rect 1.407x3.499 smd: 1(-1.853,0) 2(1.853,0)
IND-SMD_L4.1-W4.1_IHLP1616BZER4R7M11
  rect 1.4x2.3 smd: 1(-1.75,0) 2(1.75,0)
LED0603-RD_RED
  rect 0.8x0.8 smd: 1(-0.799,-0.004) 2(0.799,0.004)
LED-SMD_L128-XX80CB3500001
  rect 1x2.2 smd: 1(-1.035,0)
  rect 2.1x2.2 smd: 2(1.035,0)
Pad_e597
  round 10 smd far side: 5(0,0)
Pad_e599
  round 10 smd far side: 5(0,0)
R0603
  rect 0.806x0.864 smd: 1(-0.753,0) 2(0.753,0)
SMB_L4.4-W3.6-LS5.3-RD
  rect 2x2.4 smd: 1(-2.4,0) 2(2.4,0)
SOIC-8_L5.0-W4.0-P1.27-LS6.0-BL
  oval 0.569x1.95 smd: 1(-1.905,-2.705) 2(-0.635,-2.705) 3(0.635,-2.705) 4(1.905,-2.705) 5(1.905,2.705) 6(0.635,2.705) 7(-0.635,2.705) 8(-1.905,2.705)
SOT-23-3_L2.9-W1.3-P1.90-LS2.4-BR-2
  rect 0.7x1.25 smd: 1(0.95,-1) 2(-0.95,-1) 3(0,1)
SOT-563-6_L1.6-W1.2-P0.50-LS1.6-TL
  rect 0.68x0.28 smd: 1(-0.64,0.5) 2(-0.64,0) 3(-0.64,-0.5) 4(0.64,-0.5) 5(0.64,0) 6(0.64,0.5)

## Nets
As in the schematic, except:
GND: C5.1 C6.1 C7.1 C8.1 C9.1 C10.1 C11.1 C12.1 C13.1 C14.1 C15.1 C16.1 C17.1 C18.1 C19.1 C20.1 C21.1 C22.1 C23.1 C24.1 C45.1 C46.1 C47.1 C48.1 C49.1 C50.1 C51.1 C53.1 D1.2 LED44.1 NOREF.5 Q1.1 R7.1 R51.1 R53.1 U4.8 U5.1 U5.6
RAW_BAT+: NOREF#2.5 U7.1

Pads without a net: U4 2 3

## Via types
v1: diameter 1.3, hole 0.7, Top Layer to Bottom Layer, 65 vias
v2: diameter 0.8, hole 0.5, Top Layer to Bottom Layer, 2 vias
v3: diameter 1, hole 0.7, Top Layer to Bottom Layer, 1 via
v4: diameter 1.2, hole 0.7, Top Layer to Bottom Layer, 3 vias
v5: diameter 1, hole 0.5, Top Layer to Bottom Layer, 13 vias
v6: diameter 0.65, hole 0.3, Top Layer to Bottom Layer, 3 vias
v7: diameter 0.7, hole 0.4, Top Layer to Bottom Layer, 5 vias
v8: diameter 0.8, hole 0.4, Top Layer to Bottom Layer, 1 via
v9: diameter 0.6, hole 0.3, Top Layer to Bottom Layer, 1 via

## Routing (per net, layer and track width the routed paths; a pad name or vN(x,y) marks a point on that pad's centre or on a via; arc(x,y) is an arc through that point)
2.5V: length 532.8
  Top Layer w0.4: C52.2 60.97,15.67 60.29,16.36 58.32,16.36 57.94,15.98 57.94,13.11 57.62,12.79 53.93,12.79 53.17,13.55 L1.2
  Top Layer w0.5: 81.94,22.06 C46.2 83.4,22.52 84.06,22.66 88.42,22.5 ; C53.2 50.52,35.28 ; 3.97,24.73 4.02,24.68 v1(5.48,24.68) C6.2 7.07,24.73 8.92,24.73 ; v1(23.73,18.58) C24.2 24.09,21.82 23.21,21.82 22.62,22.4 22.62,26.16 23.14,26.68 R46.1
  Top Layer w0.6: R10.1 45.95,24.93 C5.2 43.41,24.93 42.73,24.24 ; C52.2 60.91,15.44 R49.2 ; 42.73,24.24 42.73,24.45 42.19,24.98 R11.1 ; 42.73,24.24 v1(42.73,23.72) ; C23.2 R27.1 ; C11.2 R23.1 ; R13.1 63.16,23.32 v5(64.7,23.32) 64.75,23.26 66.31,23.26 66.41,23.16 68,23.16 ; R14.1 103.71,24.73 C12.2 103.61,24.73 v1(102.04,24.73) 100.49,24.73 R15.1 ; 38.37,15.05 38.67,15.05 v1(39.63,14.1) 40.51,13.21 C22.2 R17.1 ; C9.2 R19.1 ; 66.91,12.18 68.25,13.18 68.73,13.18 v1(69.61,14.06) 70.56,15.01 R42.1 ; v5(48.16,32.51) 48.16,32.9 48.73,33.48 50.12,33.48 50.52,33.88 50.52,35.28 ; R38.1 v1(39.25,34.97) C19.2 R39.1 ; C14.2 R37.1 ; R45.1 C21.2 v1(98.33,34.96) R44.1 ; 8.16,37.02 C45.2 v4(10.82,35.04) R6.1 ; 89.61,8.86 89.61,8.36 v1(90.27,7.7) 90.43,7.54 C8.2 91,4.56 ; 31.35,42.72 R30.1 ; v7(32.95,30.11) v7(32.97,27.94)
  Top Layer w0.7: 7.75,12.22 9.08,13.2 9.22,13.34 9.6,13.34 v1(10.49,14.24) 11.33,15.07 11.66,15.07 ; R36.1 98.25,15.06 v1(99,14.31) 100.07,13.24 C14.2 ; 89.51,39.58 v1(90.2,41.01) 90.49,42.62 ; R31.1 v1(31.07,41.08) 31.35,42.72
  Top Layer w0.8: 90.49,42.62 91.02,44.2 ; R22.1 v1(20.07,41.45) C11.2 ; C23.2 v1(70.16,35.11) R26.1 ; R32.1 v1(79.1,7.19) 78.5,5.7 78.5,4.75 R33.1 ; R28.1 v1(19.99,7.35) C15.2 R29.1 ; R24.1 C10.2 v1(30.92,7.53) R25.1 ; C9.2 v1(79.33,41.35) R18.1 ; v1(31.54,23.8) 31.54,23.58 30.12,22.16 v1(30.12,20.23) 28.88,20.23 v1(27.8,19.15) 24.3,19.15 v1(23.73,18.58) 20.79,21.51 v1(19.7,21.51) 19.7,24.47 v1(19.19,24.98) 20.2,25.98 v1(20.2,28.03) 21.06,28.03 v1(23.16,30.12) 23.4,29.88 v1(27.96,29.88) 29.23,28.61 v1(29.44,28.61) ; 83.09,30.06 arc(82.66,30.51) v1(82.15,30.86) arc(82.58,30.42) 83.09,30.06 ; 83.09,30.06 arc(83.61,29.43) 84.34,29.07 arc(85.4,28.83) 86.46,28.66 arc(88.32,28.6) v1(90.17,28.73) arc(89.05,27.74) 88.05,26.64 arc(87.85,25.53) 88.39,24.53 arc(88.63,24.34) 88.9,24.19 ; 83.09,30.06 arc(82.94,29.45) 82.58,28.94 arc(81.78,28.36) 80.85,28.03 arc(79.38,28.09) v1(78.11,28.84) arc(77.95,26.18) v1(77.46,23.56) ; 81.57,16.21 arc(83.57,18.12) 85.99,19.49 ; 81.57,16.21 arc(81.44,18.47) 80.37,20.47 arc(79.2,20.65) v1(78.11,20.18) ; 81.57,16.21 arc(81.56,16.21) 81.56,16.21 ; 81.57,16.21 arc(81.56,16.16) v1(81.55,16.12) ; R47.1 arc(82.4,26.67) 81.52,26.44 arc(80.78,25.71) 80.85,24.66 arc(81.16,23.81) 81.18,22.9 arc(81.37,22.3) 81.94,22.06 ; 88.9,24.19 arc(90.1,24.03) v1(91.16,24.62) ; 88.9,24.19 arc(88.55,23.37) 88.42,22.5 arc(88.44,22.07) 88.52,21.64 arc(89.07,20.79) v1(90.03,20.46) arc(88.21,20.28) 86.45,19.76 arc(86.19,19.61) 85.98,19.4 arc(85.78,18.39) v1(86.46,17.63)
  Bottom Layer w0.4: v7(32.95,30.11) 32.65,30.59
  Bottom Layer w0.5: v7(32.97,27.94) 33.71,27.2 52.5,27.2 arc(53.1,27.45) 53.35,28.05 53.35,28.45 arc(53.31,28.7) 53.2,28.93 53.2,29.97 52.59,30.58 48.35,30.58 47.89,31.04 47.89,32.24 v5(48.16,32.51)
  Bottom Layer w0.6: v1(10.49,14.24) v1(19.7,21.51)
  Bottom Layer w0.7: v1(31.07,41.08) v1(27.96,29.88) ; v1(79.33,41.35) v1(82.15,30.86) ; v1(90.27,7.7) v1(86.46,17.63) ; v1(90.17,28.73) 87.42,31.89 v1(90.2,41.01) ; v1(99,14.31) v1(90.03,20.46) ; v1(20.07,41.45) v1(23.16,30.12)
  Bottom Layer w0.8: v1(30.92,7.53) v1(27.8,19.15) ; v1(30.12,20.23) v1(39.63,14.1) ; v1(78.11,20.18) v1(69.61,14.06) ; v1(79.1,7.19) v1(81.55,16.12) ; v1(23.73,18.58) v1(19.99,7.35) ; v4(10.82,35.04) v1(20.2,28.03) ; v1(5.48,24.68) v1(19.19,24.98) ; v1(70.16,35.11) v1(78.11,28.84) ; v1(102.04,24.73) arc(97.17,24.77) 92.31,24.91 arc(91.72,24.83) v1(91.16,24.62) ; v1(90.17,28.73) arc(91.5,30.33) 93.22,31.5 arc(95.94,32.99) v1(98.33,34.96)
  Bottom Layer w1: v1(46.83,13.35) 46.76,13.41 ; 46.76,13.41 46.74,13.41 ; 46.76,13.41 v1(48.26,13.41) v1(48.29,14.83) ; 53.78,22.2 52.78,23.2 45.22,23.2 44.22,24.2 43.2,24.2 v1(42.73,23.72) ; 53.78,22.2 54.97,23.4 64.62,23.4 v5(64.7,23.32) 77.22,23.32 v1(77.46,23.56) ; 53.78,22.2 53.64,22.06 53.64,20.6 53.6,20.56 53.6,20.55 arc(53.53,20.16) 53.33,19.82 arc(52.95,19.55) 52.5,19.45 52.36,19.45 47.79,14.87 v1(46.83,14.87) 46.83,13.59 46.68,13.44 ; 46.68,13.44 46.71,13.44 46.74,13.41 ; 46.68,13.44 46.7,13.41 46.74,13.41 ; v1(29.44,28.61) 31.51,29.87 v1(39.25,34.97)
  Bottom Layer w1.5: v1(42.73,23.72) 31.89,23.72
GND: length 484.4
  Top Layer w0.25: C47.1 52.32,17.96 54.2,17.96 ; 56.81,19.09 56.43,19.09 55.93,18.59 55.93,18.43 v6(55.85,18.34) 55.85,17.99 55.81,17.96 54.21,17.96 ; U5.1 54.2,17.94
  Top Layer w0.3: U5.6 54.2,17.94 ; 54.76,23.19 53.47,21.9 52.8,21.9 52.68,21.78
  Top Layer w0.4: 56.9,18.89 56.91,18.9 58.74,18.9 ; R51.1 59.87,15.19 v7(59.87,15.19)
  Top Layer w0.5: 50.74,31.39 50.61,31.52 v1(50.61,32.09) ; 50.74,31.39 51.95,31.39 52.19,31.63 52.19,33.15 52.29,33.25 52.29,33.74 53.74,35.19 C53.1 ; 50.74,31.39 50.52,31.18 50.52,29.87 ; v1(5.49,23.21) 6.95,23.21 C6.1
  Top Layer w0.6: C19.1 41.19,34.9 v1(40.06,33.77) ; 9.9,12.07 10.54,12.07 v1(11.38,12.91) ; C14.1 98.97,12.11 v1(98.01,13.07) ; v4(42.82,22.15) 44.07,22.15 44.35,22.43 C5.1 ; v3(38.79,13) 39.71,12.08 40.13,12.08 ; v1(64.71,24.95) 65,24.66 C13.1 ; v1(88.84,7.23) 89.1,6.96 C8.1 ; v1(99.25,33.79) C21.1 ; v1(70.48,12.84) 69.68,12.04 69.07,12.04 ; C12.1 103.6,23.21 v1(102.01,23.21)
  Top Layer w0.7: v5(82.64,18.76) 84.71,20.87 C46.1 ; v4(10.02,33.87) 8.67,34.92 ; v1(29.57,41.6) C16.1
  Top Layer w0.8: v1(18.43,7.87) C15.1 ; v5(36.03,22.2) 36.02,22.8 33.87,24.98 31.54,25.5 29.68,24.61 27.13,21.83 C24.1 ; 89.16,43.05 v1(88.71,41.46) ; 77.29,42.38 v1(77.87,40.84) ; C10.1 v1(29.48,7.09) ; 49.37,18.77 47.28,18.77 C49.1 ; 49.37,18.77 C48.1 ; 49.37,18.77 C47.1 51.51,19.55 52.5,19.55 arc(53.15,19.78) 53.49,20.38 arc(53.5,20.46) 53.5,20.55 53.5,20.95 arc(53.42,21.35) 53.19,21.68 arc(53.01,21.81) 52.8,21.9 arc(52.65,21.94) 52.5,21.95 v2(51.82,21.95) 50.91,21.95 v2(50.78,21.96) ; v1(77.63,7.66) 77.17,6.13 ; v1(69.24,33.88) C23.1 ; C11.1 v1(18.56,40.94)
  Top Layer w0.9: v1(62.75,35.74) 62.08,34.32 ; 59.93,35.75 v1(61.29,35.74)
  Bottom Layer w0.4: 55.78,18.2 v7(59.87,15.19)
  Bottom Layer w0.5: v1(61.29,35.74) 61.24,35.7 57.64,32.09 v1(50.61,32.09)
  Bottom Layer w0.6: 84.88,18.34 v5(82.64,18.76) 81.05,19.1 ; v3(38.79,13) 32.9,17.12 30.51,18.72 29.7,18.88 28.87,19.72 NOREF.5 21.39,20.79 v1(11.38,12.91)
  Bottom Layer w0.7: v1(77.87,40.84) 81.08,29.35 ; v1(88.84,7.23) 84.88,18.34 ; NOREF.5 18.69,27.43 v4(10.02,33.87) ; NOREF.5 v1(29.57,41.6) ; NOREF.5 22.15,28.62 v1(18.56,40.94) ; v1(88.71,41.46) 84.93,30.07 ; v1(98.01,13.07) 88.15,19.88
  Bottom Layer w0.8: 84.88,18.34 88.15,19.88 88.38,19.99 89.96,23.27 ; 22.34,23.87 22.45,23.89 ; 22.34,23.87 19.26,23.32 v1(5.49,23.21) ; 22.34,23.87 22.83,24.36 22.91,24.36 ; 22.34,23.87 22.26,23.79 22.23,23.76 ; v4(42.82,22.15) 44.89,22 v2(50.78,21.96) 52.06,21.95 ; 77.7,26.33 77.6,27.61 v1(69.24,33.88) ; 77.7,26.33 78.13,27.16 81.08,29.35 84.73,30.14 84.93,30.07 87.71,29.22 89.69,26.52 ; 77.7,26.33 77.41,25.75 ; 89.69,26.52 89.96,23.27 ; 89.69,26.52 90.02,26.8 v1(99.25,33.79) ; 25.57,21.82 NOREF.5 ; NOREF.5 v1(29.48,7.09) ; NOREF.5 22.39,19.26 v1(18.43,7.87) ; v1(77.63,7.66) 79.19,13.02 80.27,16.09 80.61,17.83 81.05,19.1 80.17,19.84 v1(70.48,12.84) ; v1(102.01,23.21) 89.96,23.27
  Bottom Layer w1: v1(62.75,35.74) 62.75,35.74 v1(61.29,35.74) ; v4(42.82,22.15) 30.05,22.15 27.84,24.36 ; NOREF.5 22.91,24.36 22.45,23.89 ; 22.23,23.76 22.34,23.79 22.23,23.79 22.2,23.76 22.23,23.76
  Bottom Layer w1.5: 61.24,35.7 57.52,32.09 56.39,31 54.18,26.03 ; 61.24,35.7 61.29,35.7 ; 54.18,26.03 77.41,26.03 77.7,26.33 ; 54.18,26.03 29.25,26.03 27.84,24.62 27.84,24.36
  Bottom Layer w2.2: NOREF.5 27.84,24.36 ; 77.75,26.33 77.7,26.33
ADC: length 14.4
  Top Layer w0.4: 49.29,31.57 v5(49.25,31.53) 49.25,29.87
  Top Layer w0.5: R52.1 R53.2
  Bottom Layer w0.4: v7(57.66,35.77) 57.66,34.94 55.97,33.25 49.95,33.25 49.29,32.59 49.29,31.57
BAT+: length 53.5
  Top Layer w0.3: U5.3 55.26,17.37 56.49,17.37 56.81,17.69 ; v6(55.96,19.94) 55.2,19.18 U5.4
  Top Layer w0.5: 58.25,33.75 57.39,33.75 R52.2
  Top Layer w1: 57.56,33.75 57.56,33.78 ; 58.25,33.75 58.27,32.46 59.64,31.62 60.78,31.62 62.08,30.32 62.08,30.12 ; v5(54.98,21.69) 55.91,21.69 v5(56.1,21.88) ; 56.81,17.69 58.79,17.69 58.87,17.61 59.86,17.61 ; v5(56.1,21.88) 55.98,22 56.1,22.3 v5(56.1,21.88) ; 56.14,22.67 56.14,26.07 arc(55.23,26.88) 54.9,28.05 54.9,28.45 arc(54.94,28.87) 55.06,29.28 arc(55.17,29.5) 55.3,29.71 55.3,31.11 55.34,31.16 55.34,31.27 55.68,31.61 57.05,31.61 57.7,32.26 57.7,33.75 ; 59.86,17.61 v1(62.16,17.59) v1(62.17,19.15) v1(60.6,19.15) v1(60.64,17.61) 59.86,17.61
  Bottom Layer w1: v5(54.98,21.69) 55.05,21.62 56.23,21.62 arc(56.06,21.3) 56,20.95 56,20.55 arc(56.03,20.28) 56.13,20.03 arc(56.54,19.6) 57.1,19.45 59.15,19.45 59.45,19.15 v1(60.6,19.15) ; v1(60.6,19.15) 60.64,19.1 v1(60.64,17.61) 62.13,17.61 v1(62.16,17.59) 62.16,19.14 v1(62.17,19.15) v1(60.6,19.15)
MOSFET: length 13.3
  Top Layer w0.3: Q1.2 52.98,30.82 52.49,30.82 51.79,30.12 v5(51.79,29.6)
  Top Layer w0.4: v5(46.71,31.71) 46.71,29.87
  Top Layer w0.5: 53.79,33.25 53.79,31.93
  Bottom Layer w0.4: v5(51.79,29.6) 47.27,29.6 46.76,30.11 46.76,31.66 v5(46.71,31.71)
RAW_BAT+: length 37.2
  Top Layer w1: 58.25,29.55 57.1,29.55 arc(56.32,29.23) 56,28.45 56,28.05 arc(56.32,27.27) 57.1,26.95 57.35,26.95 57.29,24.96 57.28,22.64 v5(57.83,22.1)
  Bottom Layer w1: NOREF#2.5 79.49,22.62 77.64,21.91 76.07,21.91 arc(75.83,22.01) 75.57,22.05 75.53,22.08 v5(58.87,22.08) v5(57.83,22.1)
SWITCH: length 459.6
  Top Layer w0.5: 1.64,25.65 1.74,25.75 11.06,25.75 11.16,25.65 ; 74.63,25.81 74.63,23.25 75.56,22.33 78.34,22.33 79.1,23.09 79.1,24.55 79.95,25.4 arc(80.35,26.47) 81.27,27.15 arc(81.49,27.22) 81.71,27.28 82.1,27.67 84.94,27.67 85.19,27.93 85.74,27.93 86.3,27.37 86.3,25.35 LED43.1
  Top Layer w0.6: LED38.1 70.91,16.41 67.22,13.73 64.44,11.5 ; 107.65,25.73 107.41,25.98 98.41,25.98 98.16,25.73 ; 102.45,39.12 98.8,36.67 95.66,34.39 LED40.1 ; 88.24,14.46 LED17.1 91.63,7.65 92.75,4.19 LED16.1 ; 6.79,39.15 8.31,38.23 12.51,35.18 14.54,33.51 ; 13.07,17.23 12.67,17.31 7.44,13.51 5.3,11.56 ; 37,17.21 39.49,15.58 43.59,12.6 44.76,11.57 ; 43.29,39.18 40.17,37.09 39.9,36.89 LED34.1 ; LED9.1 61.42,26.14 69.73,26.14 LED8.1 ; 38.89,25.52 39.38,26.01 48.01,26.01 LED6.1
  Top Layer w0.7: 28.59,31.14 LED27.1 31.38,38.31 32.16,40.69 33.67,46.35 ; LED30.1 91.76,41.9 90.8,38.95 89.77,36.98 87.87,31.29 ; LED14.1 80.64,41.31 79.54,44.69 LED15.1 ; 91.76,18.66 93.27,19.18 LED32.1 98.69,16.14 102.76,13.19 LED33.1 ; LED19.1 21.45,41.26 21.83,40.11 22.23,38.01 24.2,31.55 ; v5(51.08,24.53) 52.82,27.15 arc(53.28,27.5) 53.45,28.05 53.45,28.45 arc(53.44,28.6) 53.4,28.75 53.44,28.85 53.11,29.75
  Top Layer w0.8: 23.64,16.75 23.37,16.69 LED24.1 21.54,8.18 21.1,6.81 LED25.1 ; 23.64,16.75 28.63,17.88 ; 23.64,16.75 18.11,20.74 ; 17.66,25.94 18.05,25.96 18.52,27.99 19.8,29.81 ; 17.66,25.94 18.19,20.83 18.11,20.74 ; 17.66,25.94 11.16,25.65 ; LED42.1 28.16,25.58 31.77,27.11 ; 81.61,37.34 82.96,33.19 ; 82.96,33.19 83.13,32.65 arc(83.46,32.17) 83.98,31.93 arc(84.07,31.92) 84.17,31.92 arc(86.04,31.74) 87.87,31.29 ; 82.96,33.19 81.28,32.46 arc(80.65,31.84) 80.57,30.96 arc(80.46,30.32) 79.9,30.01 arc(78.9,30.17) 78.06,30.75 arc(77.85,30.91) 77.61,31.01 ; 82.96,33.19 arc(83,33.15) 83.05,33.12 ; 19.8,29.81 20.53,29.64 22.55,31.51 24.2,31.55 28.59,31.14 29.51,30.24 31.21,30.09 ; 19.8,29.81 14.54,33.51 ; 31.77,27.11 34.45,26.11 38.89,25.52 ; 31.77,27.11 31.21,30.09 ; 28.63,17.88 30.56,11.56 ; 28.63,17.88 30.13,18.76 32.29,20.22 37,17.21 ; 78.34,1.81 79.72,5.01 80.29,6.78 LED28.1 81.41,12.88 ; 18.11,20.74 13.07,17.23 ; LED38.1 74.18,18.44 76.34,18.74 79.48,18.92 80.41,18.15 80.46,17.23 80.18,16.08 80.48,15.15 ; LED23.1 69.97,36.85 72.71,34.73 LED22.1 77.61,31.01 ; 31.21,30.09 LED34.1 ; 80.48,15.15 arc(80.42,15.28) 80.36,15.42 ; 80.48,15.15 arc(80.77,14.46) 81.03,13.75 arc(81.13,13.41) 81.21,13.07 arc(82.19,13.74) 82.59,14.86 arc(82.9,16.03) 83.68,16.97 arc(84.48,17.17) 85.18,16.74 arc(86.06,15.72) 87.11,14.9 arc(87.63,14.55) 88.13,14.18 arc(88.19,14.32) 88.24,14.46 arc(88.39,15.81) 87.96,17.11 arc(87.92,18.03) 88.66,18.58 arc(89.92,18.71) 91.18,18.71 arc(91.47,18.69) 91.76,18.66 arc(91.5,20.32) 91.13,21.94 arc(91.3,22.73) 92.05,23.04 arc(92.71,23.31) 92.83,24.01 arc(92.95,24.98) 93.78,25.48 arc(95.96,25.61) LED11.1 ; LED20.1 32.53,6.7 LED21.1 ; 77.61,31.01 arc(77.1,31) 76.68,30.71 arc(76.71,30.25) 76.61,29.79 arc(76.43,28.98) 76.52,28.15 arc(76.17,26.5) 74.63,25.81 arc(72.47,25.79) LED8.1 ; LED40.1 94.51,33.48 92.74,31.7 arc(92.73,31.54) 92.74,31.37 arc(92.75,31.06) 92.74,30.75 ; 88.12,31.09 arc(88.41,30.33) 89.13,29.97 arc(89.88,30.08) 90.49,30.52 arc(91.57,31.08) 92.74,30.75 ; 92.74,30.75 arc(92.65,30.15) 92.47,29.58 arc(91.93,28.55) 91.18,27.67 arc(90.88,26.93) 91.24,26.22 arc(92.2,25.7) 93.28,25.51
  Top Layer w1: LED6.1 50.65,25.5 v5(51.08,24.53) ; v5(58.5,24.55) 59.12,25.54 LED9.1
  Bottom Layer w1: v5(58.5,24.55) v5(51.08,24.53)
$1N2397: length 2.4
  Top Layer w0.6: 5.58,37.48 7.27,35.8
$1N2467: length 2.4
  Top Layer w0.6: 13.32,31.84 R6.2
$1N2959: length 2.3
  Top Layer w0.5: 8.92,23.22 8.92,23.31 8.94,23.33 11.16,23.33
$1N2961: length 2.4
  Top Layer w0.5: 1.68,23.63 1.64,23.58 ; 4.05,23.37 1.68,23.37
$1N3108: length 2.5
  Top Layer w0.6: R10.2 48.47,23.48 LED6.2
$1N3110: length 2.4
  Top Layer w0.6: LED7.2 38.92,23.48 R11.2
$1N3257: length 2.8
  Top Layer w0.6: LED8.2 69.57,24.22 68.45,24.22 R12.2
$1N3259: length 2.9
  Top Layer w0.6: LED9.2 61.66,24.31 62.45,24.31 62.95,24.81 R13.2
$1N3406: length 2.5
  Top Layer w0.6: 107.64,23.58 107.28,23.22 R14.2
$1N3408: length 2.5
  Top Layer w0.6: LED11.2 98.51,23.22 R15.2
$1N4472: length 2.4
  Top Layer w0.6: R16.2 35.78,15.53
$1N4474: length 2.4
  Top Layer w0.6: R17.2 43.54,9.89
$1N4476: length 2.4
  Top Layer w0.6: R18.2 79.21,37.18
$1N4478: length 2.4
  Top Layer w0.6: R19.2 76.29,46.31
$1N4480: length 2.4
  Top Layer w0.6: 89.69,3.79 89.68,3.78 90.77,1.66 90.78,1.66
$1N4482: length 2.4
  Top Layer w0.6: 88.17,8.39 87.81,10.8
$1N4484: length 2.4
  Top Layer w0.6: 18.87,39.44 19.98,37.27
$1N4486: length 2.4
  Top Layer w0.6: 17.41,44.03 17.01,46.44
$1N4488: length 2.4
  Top Layer w0.6: 30.45,3.9 31.53,1.78
$1N4490: length 2.7
  Top Layer w0.8: R25.2 28.5,9.71 LED21.2
$1N5215: length 2.4
  Top Layer w0.6: R26.2 72.58,31.8
$1N5217: length 2.4
  Top Layer w0.6: 66.54,35.76 64.81,37.43
$1N5219: length 2.4
  Top Layer w0.6: 20,11.41 R28.2
$1N5221: length 2.4
  Top Layer w0.6: 17.4,4.66 17.02,2.28
$1N5223: length 2.4
  Top Layer w0.6: 31.55,46.92 R30.2
$1N5225: length 2.5
  Top Layer w0.6: R31.2 28.55,37.8
$1N5227: length 2.5
  Top Layer w0.6: R32.2 79.14,11.29
$1N5229: length 2.9
  Top Layer w0.6: R33.2 76.19,4.34 76.19,2.14
$1N5231: length 2.4
  Top Layer w0.6: R34.2 90.69,46.8
$1N5233: length 2.4
  Top Layer w0.6: R35.2 87.71,37.7
$1N5958: length 2.3
  Top Layer w0.6: 96.69,13.84 95.02,15.49
$1N5960: length 2.4
  Top Layer w0.6: R37.2 102.79,9.84
$1N5962: length 2.5
  Top Layer w0.6: R38.2 LED34.2
$1N5964: length 2.5
  Top Layer w0.6: R39.2 44.51,37.5
$1N5966: length 2.4
  Top Layer w0.7: 8.64,11 6.52,9.88
$1N5968: length 2.4
  Top Layer w0.7: R41.2 14.28,15.55
$1N5970: length 2.5
  Top Layer w0.6: R42.2 LED38.2
$1N5972: length 2.4
  Top Layer w0.6: 67.79,10.96 65.66,9.83
$1N5974: length 2.4
  Top Layer w0.6: R44.2 LED40.2
$1N5976: length 2.4
  Top Layer w0.6: R45.2 103.67,37.44
$1N6160: length 3
  Top Layer w0.5: LED42.2 24.09,25.12 R46.2
$1N6162: length 2.9
  Top Layer w0.8: R47.2 LED43.2
$1N26713: length 0.7
  Top Layer w0.3: 54.73,16.74 54.71,16.72 54.71,16.67 54.7,16.69 U5.2
$1N26861: length 18.4
  Top Layer w0.3: v6(54.65,19.87) 54.7,19.82 U5.5
  Top Layer w0.4: v7(59.83,13.6) 59.12,13.6 R51.2 59.03,13.19 59.45,12.78 62.17,12.78 62.42,13.02 R49.1
  Top Layer w0.6: C52.1 62.42,15.47 R49.1
  Bottom Layer w0.3: v6(54.65,19.87) 54.65,16.79 57.84,13.6 v7(59.83,13.6)
$1N27838: length 2.3
  Top Layer w0.25: R55.1 53.16,23.6 LED44.2
$1N27880: length 19.1
  Top Layer w0.25: R55.2 53.05,25.21 53.05,25.78 54.09,26.82 54.09,30.39 54.55,30.85 54.55,31.93 54.92,32.3 54.92,33.5 v9(54.33,34.09)
  Top Layer w0.4: 46.71,35.28 46.71,33.89
  Bottom Layer w0.3: v8(46.73,33.84) 46.97,34.09 v9(54.33,34.09)

## Copper pours and planes (outline as drawn; the poured copper is in the pictures)
2.5V on Top Layer: 54.23,11.92 54.08,17 52.31,17.74 52.01,17.77 45.5,17.72 45.53,13.25 46.03,12.48 46.6,12.25
GND on Top Layer: -9.58,58.86 -0.4,-6.33 110.4,-3.88 112.24,44.78 93.27,55.65 73.37,54.89 57.76,43.25 64.21,35.95 63.94,31.45 56.77,31.45 53.1,32.49 51.8,32.52 51.04,33.54 50.94,37.84 46.75,59.24 46.61,62.51
GND on Bottom Layer: -14.08,60.71 121.89,60.71 121.89,-18.7 -14.08,-18.7
$1N26713 on Top Layer: 57.43,15.95 57.43,13.26 55.9,13.26 54.48,14.68 54.48,16.96 54.54,17.02 54.91,17.02 55.21,16.71 56.16,16.71 56.3,16.58 56.97,16.58

Small or netless copper shapes (teardrops, artwork), in the pictures only: 1 on Top Layer

## Text on the board
Bottom Silkscreen Layer: Gazi MF | bukajlag | Sponzored by MrShu | robotfuze.com | - | +
Top Silkscreen Layer: robotfuze.com | 2.5V | 2024 | bukajlag
